# Altium schematic sheet TOP.SchDoc
size A4; SheetNumber: 1; SheetTotal: 4
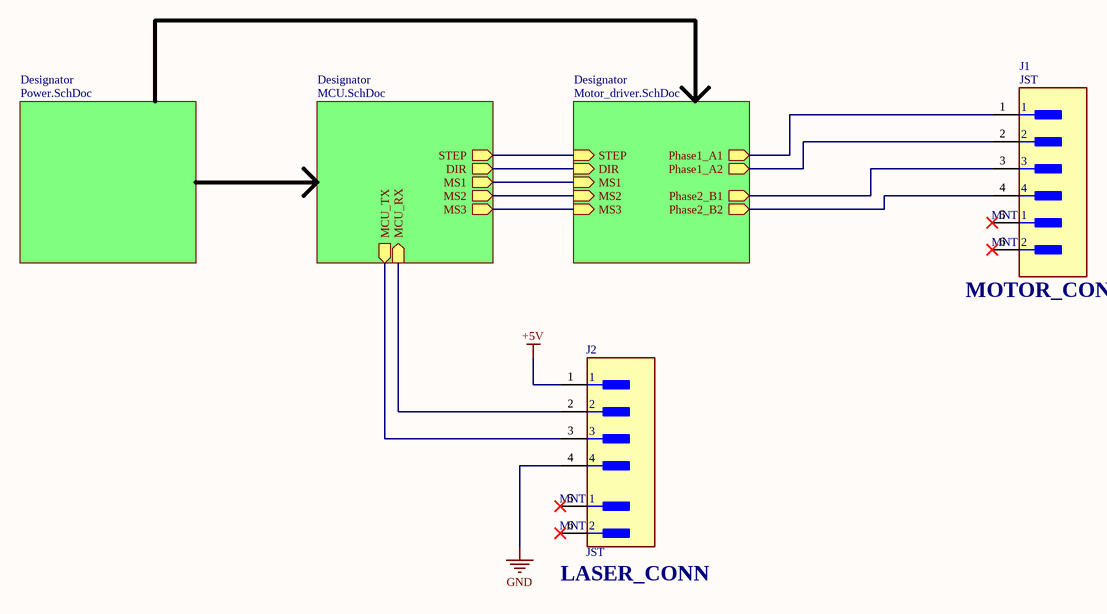
[diagram p0: TOP.SchDoc]

## Parts
J1  Manufacturer: JST  [FP-SM04B-PASS-TBT_LF_SN-MFG]  (hidden comment: SM04B-PASS-TBT(LF)(SN))
J2  Model: JST  [FP-B4B-PH-SM4-TBT_LF_SN-MFG]  (hidden comment: B4B-PH-SM4-TBT(LF)(SN))

## Sub-sheets
Designator = Power.SchDoc: no entries
Designator = MCU.SchDoc: STEP (out), DIR (out), MS1 (out), MS2 (out), MS3 (out), MCU_RX (in), MCU_TX (out)
Designator = Motor_driver.SchDoc: STEP (in), MS1 (in), MS2 (in), MS3 (in), DIR (in), Phase1_A1 (out), Phase1_A2 (out), Phase2_B1 (out), Phase2_B2 (out)

## Nets
+5V: J2.1
GND: J2.4
NetJ1_1: J1.1 ; sheet Designator/Phase1_A1
NetJ1_2: J1.2 ; sheet Designator/Phase1_A2
NetJ1_3: J1.3 ; sheet Designator/Phase2_B1
NetJ1_4: J1.4 ; sheet Designator/Phase2_B2
NetJ2_2: J2.2 ; sheet Designator/MCU_RX
NetJ2_3: J2.3 ; sheet Designator/MCU_TX
(unnamed): sheet Designator/STEP, sheet Designator/STEP
(unnamed): sheet Designator/DIR, sheet Designator/DIR
(unnamed): sheet Designator/MS1, sheet Designator/MS1
(unnamed): sheet Designator/MS2, sheet Designator/MS2
(unnamed): sheet Designator/MS3, sheet Designator/MS3

Not connected (* = marked no-connect by the designer): J1 5(MNT_1)* 6(MNT_2)*; J2 5(MNT_1)* 6(MNT_2)*

## Notes on the sheet
- (near J1) MOTOR_CONN
- (near J2) LASER_CONN

## Library data of the parts
J1 = CMP-2000-07078-2: CONN HEADER SMD R/A 4POS 2MM; Voltage Rating: 250V; Current Rating: 3A; Conn Gender: Male; Conn Orientation: Right Angle; Number Of Contacts: 4; Height: 5.7mm; Contact Material: Tin; Device Class L2: Headers and Wire Housings; Number Of Rows: 1; Device Class L1: Connectors; RoHS: TRUE; Lead Free: Yes; Automotive: No; Digikey Description: CONN HEADER SMD R/A 4POS 2MM; Manufacturer Part Number: SM04B-PASS-TBT(LF)(SN); Temperature: -25°C to +85°C; Package: SM04B-PASS-TBT(LF)(SN); Temperature Range Low: -25°C; ComponentLink2Description: Datasheet; Temperature Range High: +85°C; Pitch: 2mm; ComponentLink2URL: http://www.jst-mfg.com/product/pdf/eng/ePA-F.pdf; Octopart: https://octopart.com/sm04b-pass-tbt%28lf%29%28sn%29-jst-3990422; Category: Conn; Device Class L3: unset
J2 = CMP-17439-000271-1: CONN HEADER SMD 4POS 2MM; Voltage Rating: 100V; Contact Resistance: 20mR; Mated Stacking Heights: 8.6mm; Number of Positions: 4; Max Current Rating: 2A; Color: Natural; Connector Type: Header; Mount: Surface Mount; Contact Finish - Mating: TIN; Contact Material: Copper Alloy; Contact Mating Length: 0.13inch; Contact Plating: Copper; Max Operating Temperature: 85°C; Termination: Solder; Fastening Type: Detent; Min Operating Temperature: -25°C; Contact Shape: Square; Flammability Rating: UL94 V-0; Housing Material: Polyamide; Contact Type: Male Pin; Housing Color: Beige; Depth: 5mm; Packaging: Tape and Reel; Number of Rows: 1; Insulation Color: Natural; Length: 11.95mm; Max Voltage Rating (AC): 100V; Orientation: Straight; Insulation Material: Nylon; Pitch: 2mm; Package Quantity: 1; Series: PH; Lead Free: Lead Free